# Altium schematic sheet LVDS_IFCB.SchDoc: LVDS Interface
size 420 x 297 mm; Author: G.K.; CompanyName: WUT; DrawnBy: G.K.; Organization: CERN; Address1: Warsaw Univeristy of Technology; Address2: Nowowiejska 15/19; DocumentNumber: 4; Revision: -; SheetNumber: 4; SheetTotal: 5; EDA_Number: ARTIQ; Projet: Sampler; ModifiedBy: -; CreateDate: XX/XX/XXXX; CheckedDate: -; Title2: I2C logic; DivGrp: ISE; Designer: G.K.; ModifiedDate: -; ProjectName: Sampler
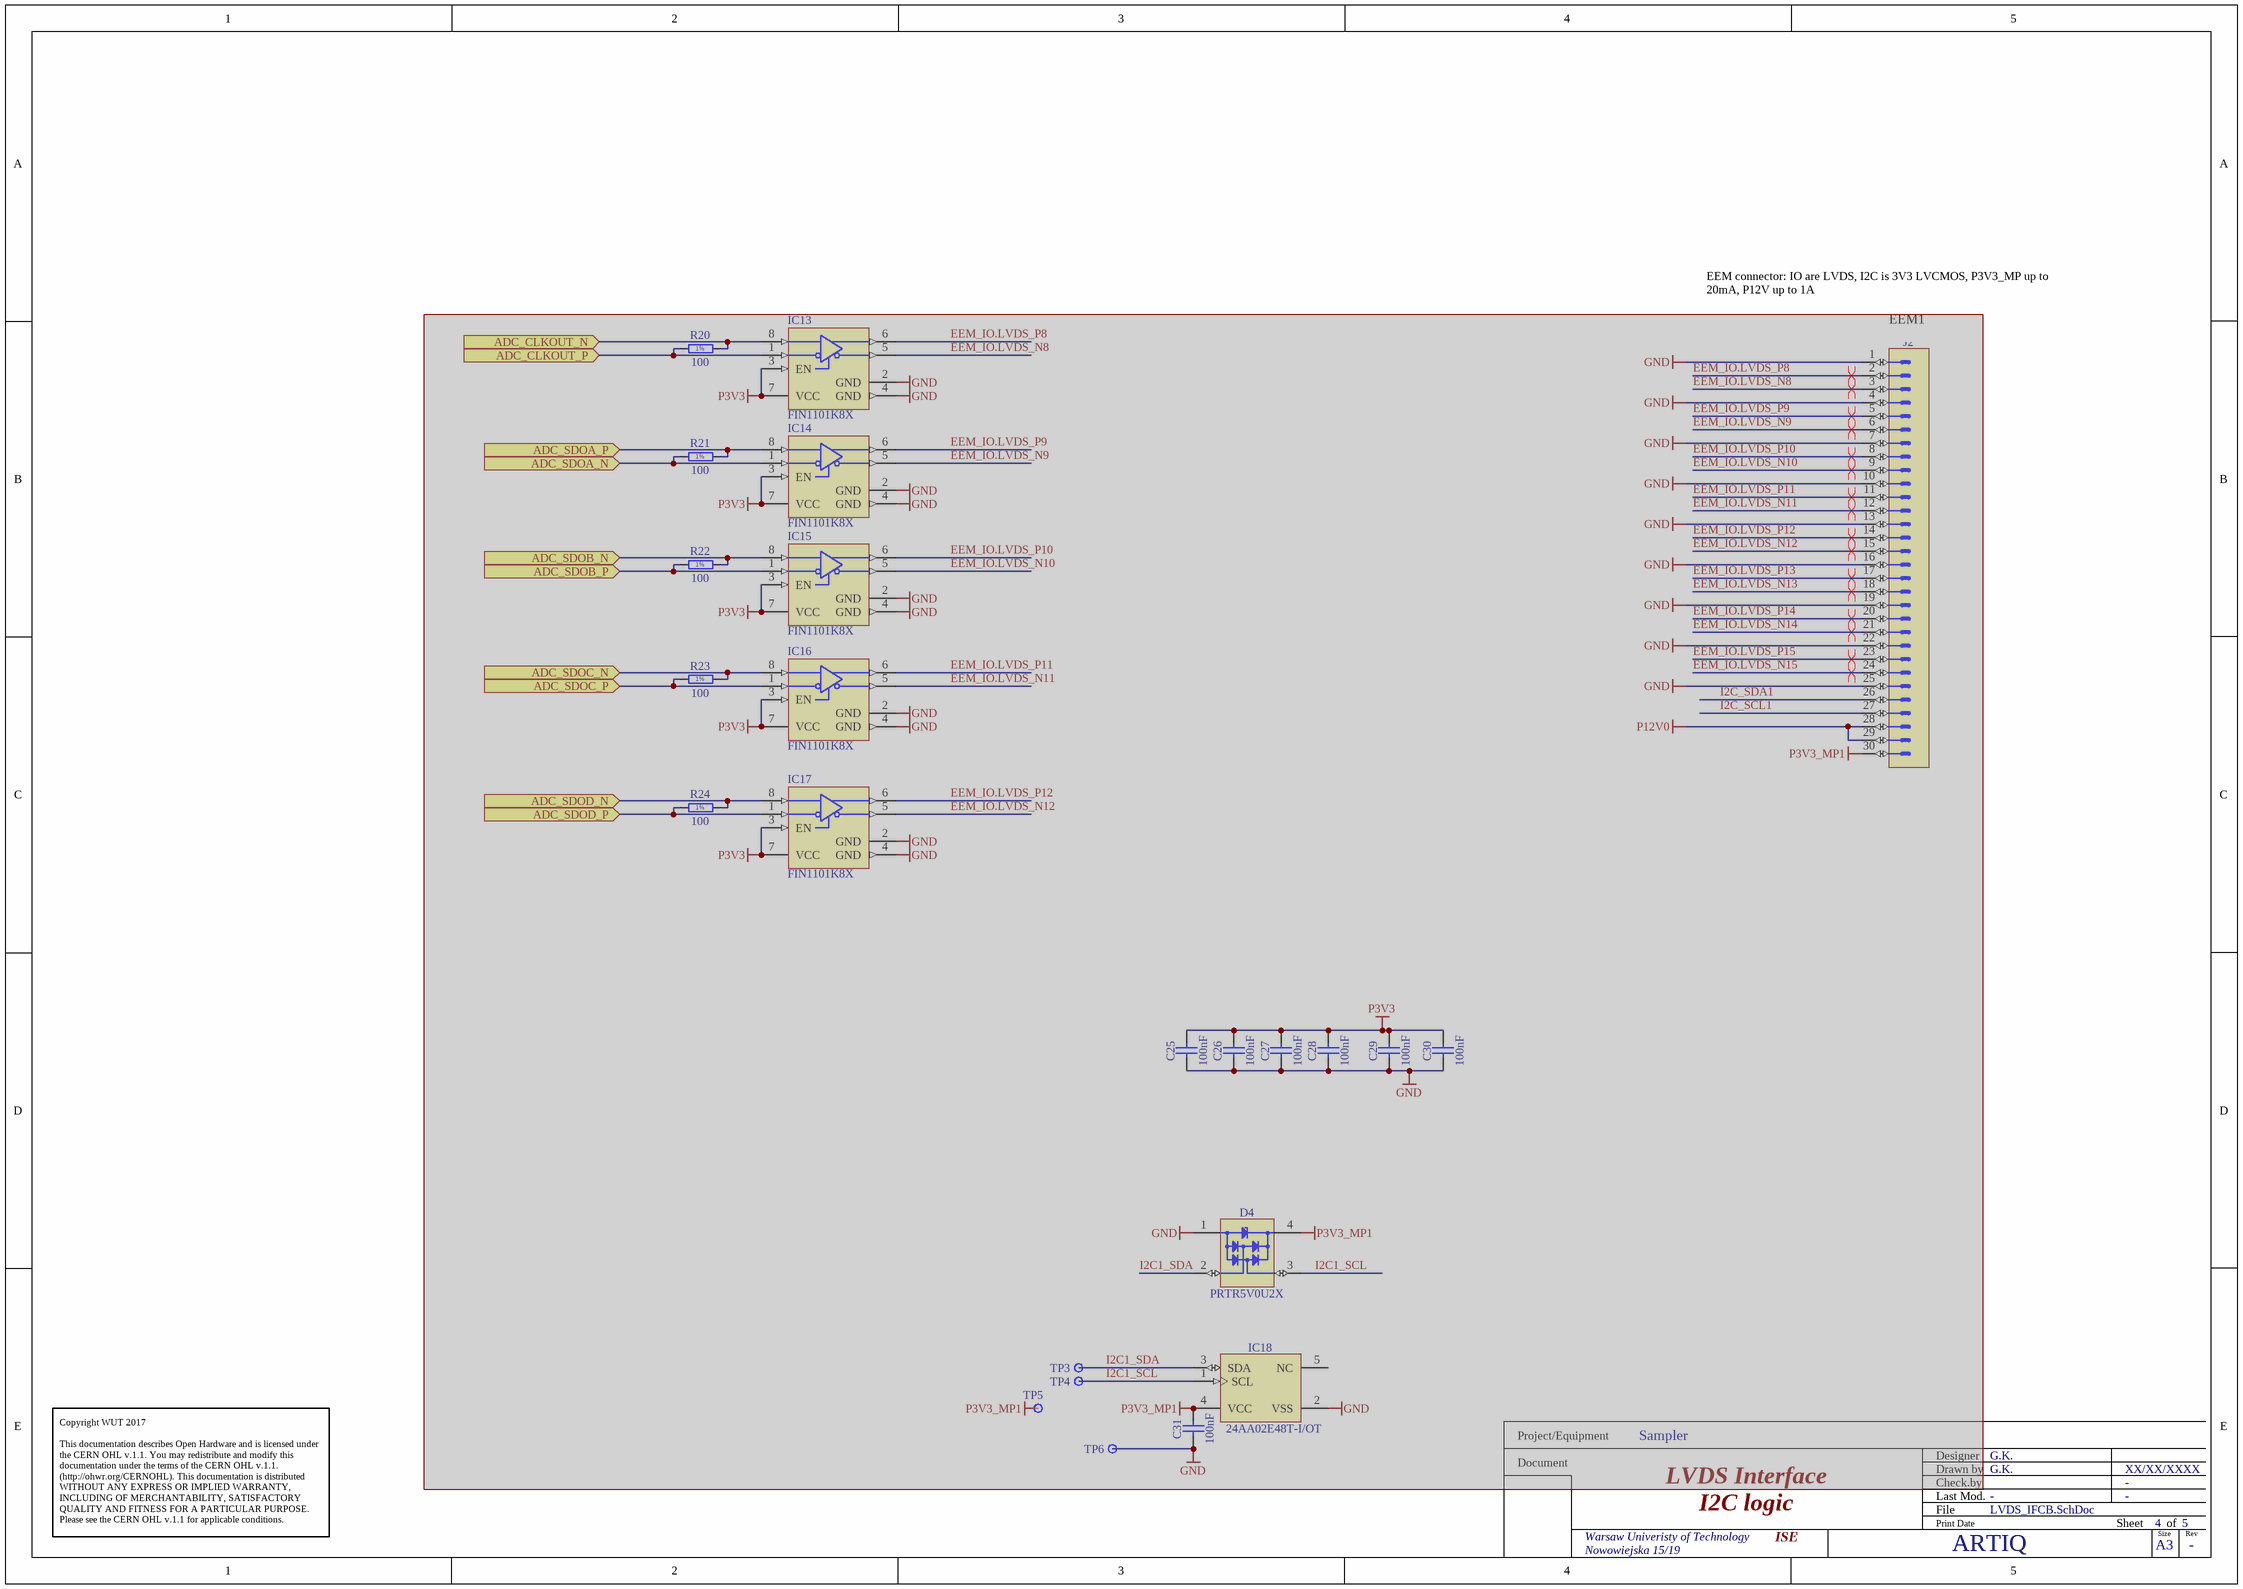
[diagram p0: LVDS_IFCB.SchDoc]

## Parts
C25  100nF  [CAPC1005X55N]  (masked out: inside a compile mask, not in the netlist)
C26  100nF  [CAPC1005X55N]  (masked out: inside a compile mask, not in the netlist)
C27  100nF  [CAPC1005X55N]  (masked out: inside a compile mask, not in the netlist)
C28  100nF  [CAPC1005X55N]  (masked out: inside a compile mask, not in the netlist)
C29  100nF  [CAPC1005X55N]  (masked out: inside a compile mask, not in the netlist)
C30  100nF  [CAPC1005X55N]  (masked out: inside a compile mask, not in the netlist)
C31  100nF  [CAPC1005X55N]  (masked out: inside a compile mask, not in the netlist)
D4  PRTR5V0U2X  [SOT190P230X110-4N]  (masked out: inside a compile mask, not in the netlist)
IC13  FIN1101K8X  [SOP50P310X90-8N]  (masked out: inside a compile mask, not in the netlist)
IC14  FIN1101K8X  [SOP50P310X90-8N]  (masked out: inside a compile mask, not in the netlist)
IC15  FIN1101K8X  [SOP50P310X90-8N]  (masked out: inside a compile mask, not in the netlist)
IC16  FIN1101K8X  [SOP50P310X90-8N]  (masked out: inside a compile mask, not in the netlist)
IC17  FIN1101K8X  [SOP50P310X90-8N]  (masked out: inside a compile mask, not in the netlist)
IC18  24AA02E48T-I/OT  [SOT95P280X145-5N]  (masked out: inside a compile mask, not in the netlist)
J2  (no value)  [3M_N2530-6002RB]  (masked out: inside a compile mask, not in the netlist)
R20  100  [RESC1005X40N]  (masked out: inside a compile mask, not in the netlist)
R21  100  [RESC1005X40N]  (masked out: inside a compile mask, not in the netlist)
R22  100  [RESC1005X40N]  (masked out: inside a compile mask, not in the netlist)
R23  100  [RESC1005X40N]  (masked out: inside a compile mask, not in the netlist)
R24  100  [RESC1005X40N]  (masked out: inside a compile mask, not in the netlist)
TP3  Test Point  [TPS127]  (value not drawn)  (masked out: inside a compile mask, not in the netlist)
TP4  Test Point  [TPS127]  (value not drawn)  (masked out: inside a compile mask, not in the netlist)
TP5  Test Point  [TPS127]  (value not drawn)  (masked out: inside a compile mask, not in the netlist)
TP6  Test Point  [TPS127]  (value not drawn)  (masked out: inside a compile mask, not in the netlist)

## Ports
ADC_CLKOUT_N (in), ADC_CLKOUT_P (in), ADC_SDOA_N (in), ADC_SDOA_P (in), ADC_SDOB_N (in), ADC_SDOB_P (in), ADC_SDOC_N (in), ADC_SDOC_P (in), ADC_SDOD_N (in), ADC_SDOD_P (in)

## Layout directives
differential pair: (no net found under the mark)

## Notes on the sheet
- (near J2) EEM1
- (near J2) EEM connector: IO are LVDS, I2C is 3V3 LVCMOS, P3V3_MP up to 20mA, P12V up to 1A
- Copyright WUT 2017
  This documentation describes Open Hardware and is licensed under the CERN OHL v.1.1. You may redistribute and modify this documentation under the terms of the CERN OHL v.1.1. (http://ohwr.org/CERNOHL). This documentation is distributed WITHOUT ANY EXPRESS OR IMPLIED WARRANTY, INCLUDING OF MERCHANTABILITY, SATISFACTORY QUALITY AND FITNESS FOR A PARTICULAR PURPOSE. Please see the CERN OHL v.1.1 for applicable conditions.
- Project/Equipment
- Document
- Designer
- Drawn by
- Check.by
- File
- Last Mod.
- Print Date
- Sheet
- Size
- A3
- of
- Rev
- (in symbol R0402_100R_1%_0.1W_100PPM) 1%

## Library data of the parts
C25-C31 = CC0402_100NF_16V_10%_X5R: Non-polarised capacitor; Part Description: SMD Multilayer Chip Ceramic Capacitor; Manufacturer: GENERIC; Manufacturer1 Part Number: GRM155R61C104KA88D; Voltage: 16V; TC: X5R; Tolerance: ±10%; Part Number: CC0402_100NF_16V_10%_X5R; Component Kind: Standard; Component Type: Standard; Pin Count: 2; Value: 100nF; Status: None; Manufacturer Part Number: CC0402_100NF_16V_10%_X5R; Case: 0402; Mounted: Yes; Socket: No; SMD: Yes; Sense: No; Manufacturer1 Example: MURATA; Manufacturer1 ComponentHeight: 0.55mm; HelpURL: \\cern.ch\dfs\Applications\Altium\Datasheets\CC0402_X5R_MURATA_GRM.pdf; Author: CERN DEM JLC; CreateDate: 10.12.2013; LatestRevisionDate: 10.12.2013
D4 = PRTR5V0U2X: Ultra Low Capacitance Double Rail-to-Rail ESD Protection Diode; Part Description: Ultra Low Capacitance (1pF) Double Rail-to-Rail ESD Protection Diode (8kV); Manufacturer: NXP SEMICONDUCTORS; Voltage: 5.5V; PressFit: No; Bonding: No; Part Number: PRTR5V0U2X; Component Kind: Standard; Component Type: Standard; Device: PRTR5V0U2X; PackageDescription: SOT143B, SOT, 1.90mm Pitch; 4 Pin, 1.30mm W X 2.90mm L X 1.10mm H body, IPC Medium Density; Manufacturer Part Number: PRTR5V0U2X; Pin Count: 4; Case: SOT143B; Mounted: Yes; Socket: No; SMD: Yes; Sense: No; ComponentHeight: 1.1mm; HelpURL: \\cern.ch\dfs\Applications\Altium\Datasheets\PRTR5V0U2X.pdf; Author: CERN DEM JLC; CreateDate: 22.03.2011; LatestRevisionDate: 22.03.2011
IC13-IC17 = FIN1101K8X: LVDS Single Port High Speed Repeater; Manufacturer: FAIRCHILD SEMICONDUCTOR; PressFit: No; Bonding: No; Part Number: FIN1101K8X; Component Kind: Standard; Component Type: Standard; Device: FIN1101K8X; PackageDescription: SOP, 0.50mm Pitch; 8 pin, 2.30mm W X 2.00mm L X 0.90mm H body, PC Medium Density; Part Description: LVDS Single Port High Speed Repeater; Manufacturer Part Number: FIN1101K8X; Pin Count: 8; Case: TSSOP8; Mounted: Yes; Socket: No; SMD: Yes; Sense: No; ComponentHeight: 0.8mm; Author: CERN DEM JLC; HelpURL: \\cern.ch\dfs\Applications\Altium\Datasheets\FIN1101K8X.pdf; CreateDate: 08.11.2016; LatestRevisionDate: 08.11.2016
IC18 = 24AA02E48T-I/OT: 1.7V-5.5V, 2K I2C Serial EEPROM With EUI-48 Node Identity; Manufacturer: MICROCHIP TECHNOLOGY; PressFit: No; Bonding: No; Part Number: 24AA02E48T-I/OT; Component Kind: Standard; Component Type: Standard; Device: 24AA02E48T-I/OT; PackageDescription: SOT, 0.95mm pitch; 5 pin, 1.60mm W X 2.90mm L X 1.45mm H body, IPC Medium Density; Part Description: 1.7V-5.5V, 2K I2C Serial EEPROM With EUI-48 Node Identity; Manufacturer Part Number: 24AA02E48T-I/OT; Pin Count: 5; Case: SOT23-5; Mounted: Yes; Socket: No; SMD: Yes; Sense: No; ComponentHeight: 1.45mm; HelpURL: \\cern.ch\dfs\Applications\Altium\Datasheets\24AA02E48T-I-OT.pdf; Author: CERN DEM MR; CreateDate: 31.03.2016; LatestRevisionDate: 31.03.2016
J2 = 3M_N2530-6002RB: Connector 30 Male; Part Description: 30 Contacts - Straight .100'' x .100'' Low Profile Four-Wall Header, 2500 Series; Manufacturer: 3M; PressFit: No; Part Number: 3M_N2530-6002RB; Component Kind: Standard; Component Type: Standard; Pin Count: 30; Family: Header 30; Mounted: Yes; Socket: No; SMD: No; Sense: No; Status: None; Manufacturer Part Number: N2530-6002RB; ComponentHeight: 10.03mm; HelpURL: \\cern.ch\dfs\Applications\Altium\Datasheets\3M_N2530-6002RB.pdf; Author: CERN DEM JLC; CreateDate: 11.02.2009; LatestRevisionDate: 11.08.2009
R20-R24 = R0402_100R_1%_0.1W_100PPM: Resistor - 1%; Part Description: General Purpose Thick Film Chip Resistor; Manufacturer: GENERIC; Manufacturer Part Number: R0402_100R_1%_0.1W_100PPM_50V; Manufacturer1 Part Number: ERJ2RKF1000X; Power: 0.1W; TC: ±100ppm/°C; Voltage: 50V; Part Number: R0402_100R_1%_0.1W_100PPM; Component Kind: Standard; Component Type: Standard; Pin Count: 2; Value: 100; Status: Not recommended; Tolerance: ±1%; Case: 0402; Mounted: Yes; Sense: No; Socket: No; SMD: Yes; Manufacturer1 Example: PANASONIC; Manufacturer1 ComponentHeight: 0.4mm; HelpURL: \\cern.ch\dfs\Applications\Altium\Datasheets\R0402_PANASONIC_ERJ2RK.pdf; Author: CERN DEM JLC; CreateDate: 12.12.2013; LatestRevisionDate: 03.03.2015
TP3-TP6 = SMD_PAD_1.27X1.27MM: Part Description: 1.27mm x 1.27mm PCB Copper Area (SMD Test Point); Mounted: No; Part Number: SMD_PAD_1.27X1.27MM; Component Kind: Standard (No BOM); Component Type: Standard (No BOM); Pin Count: 1; Family: Test Point; Socket: No; SMD: Yes; Sense: No; Status: None; ComponentHeight: 0mm; HelpURL: Undefined; Author: CERN DEM JLC; CreateDate: 12.01.2008; LatestRevisionDate: 12.01.2008; PackageDescription: 1.27mm x 1.27mm PCB Copper Area (SMD Test Point)